# Altium schematic sheet VCAN.SchDoc
size 209 x 148 mm; Author: vseasky; Address1: https://docs.liuwei.vin; Revision: V0.2; SheetNumber: 1; SheetTotal: 4
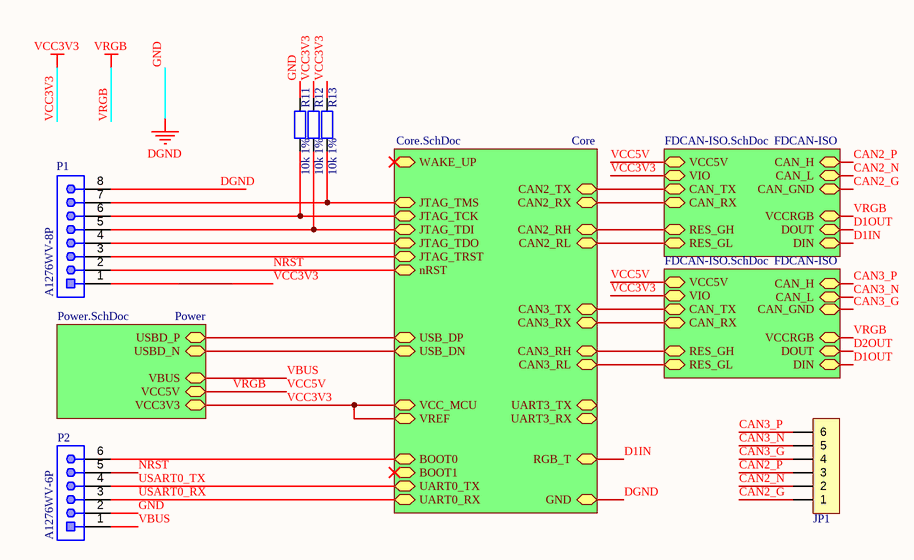
[diagram p0: VCAN.SchDoc]

## Parts
JP1  HDR-1X6  [HT3.96-WI-6P-SMD]  (value not drawn)
P1  A1276WV-8P  [CJT-A1276WV-8P_V]
P2  A1276WV-6P  [CJT-A1276WV-6P_V]
R11  10k 1%  [R 0603_L]
R12  10k 1%  [R 0603_L]
R13  10k 1%  [R 0603_L]

## Sub-sheets
Core = Core.SchDoc: nRST (bidir), WAKE_UP (bidir), JTAG_TDO (bidir), JTAG_TDI (bidir), JTAG_TCK (bidir), JTAG_TMS (bidir), JTAG_TRST (bidir), GND (bidir), USB_DP (bidir), USB_DN (bidir), UART0_TX (bidir), UART0_RX (bidir), VCC_MCU (bidir), VREF (bidir), BOOT0 (bidir), BOOT1 (bidir), UART3_RX (bidir), UART3_TX (bidir), CAN3_RX (bidir), CAN3_TX (bidir), RGB_T (bidir), CAN2_TX (bidir), CAN2_RX (bidir), CAN3_RH (bidir), CAN2_RH (bidir), CAN2_RL (bidir), CAN3_RL (bidir)
FDCAN-ISO = FDCAN-ISO.SchDoc: CAN_H (bidir), CAN_L (bidir), CAN_RX (bidir), CAN_TX (bidir), CAN_GND (bidir), VCC5V (bidir), VIO (bidir), RES_GH (bidir), RES_GL (bidir), VCCRGB (bidir), DOUT (bidir), DIN (bidir)
FDCAN-ISO = FDCAN-ISO.SchDoc: CAN_H (bidir), CAN_L (bidir), CAN_RX (bidir), CAN_TX (bidir), CAN_GND (bidir), VCC5V (bidir), VIO (bidir), RES_GH (bidir), RES_GL (bidir), VCCRGB (bidir), DOUT (bidir), DIN (bidir)
Power = Power.SchDoc: VCC3V3 (bidir), VCC5V (bidir), USBD_P (bidir), USBD_N (bidir), VBUS (bidir)

## Nets
DGND: P1.8 P2.2 R11.1 ; sheet Core/GND  [also labelled GND]
VCC3V3: P1.1 R12.1 R13.1 ; sheet Core/VCC_MCU, sheet Core/VREF, sheet Power/VCC3V3, sheet FDCAN-ISO/VIO, sheet FDCAN-ISO/VIO
VCC5V: sheet Power/VCC5V, sheet FDCAN-ISO/VCC5V, sheet FDCAN-ISO/VCCRGB, sheet FDCAN-ISO/VCC5V, sheet FDCAN-ISO/VCCRGB  [also labelled VRGB]
CAN2_G: JP1.1 ; sheet FDCAN-ISO/CAN_GND
CAN2_N: JP1.2 ; sheet FDCAN-ISO/CAN_L
CAN2_P: JP1.3 ; sheet FDCAN-ISO/CAN_H
CAN3_G: JP1.4 ; sheet FDCAN-ISO/CAN_GND
CAN3_N: JP1.5 ; sheet FDCAN-ISO/CAN_L
CAN3_P: JP1.6 ; sheet FDCAN-ISO/CAN_H
D1IN: sheet Core/RGB_T, sheet FDCAN-ISO/DIN
D1OUT: sheet FDCAN-ISO/DOUT, sheet FDCAN-ISO/DIN
D2OUT: sheet FDCAN-ISO/DOUT
NRST: P1.2 P2.5 ; sheet Core/nRST
USART0_RX: P2.3 ; sheet Core/UART0_RX
USART0_TX: P2.4 ; sheet Core/UART0_TX
VBUS: P2.1 ; sheet Power/VBUS
NetP1_3: P1.3 ; sheet Core/JTAG_TRST
NetP1_4: P1.4 ; sheet Core/JTAG_TDO
NetP1_5: P1.5 R12.2 ; sheet Core/JTAG_TDI
NetP1_6: P1.6 R11.2 ; sheet Core/JTAG_TCK
NetP1_7: P1.7 R13.2 ; sheet Core/JTAG_TMS
NetP2_6: P2.6 ; sheet Core/BOOT0
(unnamed): sheet Core/USB_DP, sheet Power/USBD_P
(unnamed): sheet Core/USB_DN, sheet Power/USBD_N
(unnamed): sheet Core/CAN3_RX, sheet FDCAN-ISO/CAN_RX
(unnamed): sheet Core/CAN3_TX, sheet FDCAN-ISO/CAN_TX
(unnamed): sheet Core/CAN2_TX, sheet FDCAN-ISO/CAN_TX
(unnamed): sheet Core/CAN2_RX, sheet FDCAN-ISO/CAN_RX
(unnamed): sheet Core/CAN3_RH, sheet FDCAN-ISO/RES_GH
(unnamed): sheet Core/CAN2_RH, sheet FDCAN-ISO/RES_GH
(unnamed): sheet Core/CAN2_RL, sheet FDCAN-ISO/RES_GL
(unnamed): sheet Core/CAN3_RL, sheet FDCAN-ISO/RES_GL

## Library data of the parts
JP1 = Header 6: 6P接插件
P1 = A1276WV-8P: Pin Header, 1.27mm Pitch 180° Single Row, 1 x 8 Position, Height 3.7 mm, -40 to 105 degC, RoHS; Manufacturer: Changjiang Connectors; Contact Resistance: 20mΩ; Current (Max): 1A; Insulation Resistance: 1000MΩ; No. of Rows: 1; No. of Positions: 8; Operating Voltage (V AC/DC): 30V; PIN Material: Brass; PIN Plating: Gold over Nickel; Product Series: A1276 Series; ComponentLink1Description: Manufacturer; ComponentLink1URL: http://www.cjt.com/; ComponentLink2Description: Datasheet; ComponentLink2URL: http://www.cjt.com/UP/A1276WV-XP_dwg.pdf; Part Number: A1276WV-8P; Pitch: 1.27mm; Datasheet Version: REV. A0, 06/2014; Assembly Type: Wafer; Category: Wire to Board; Color: Black; Housing Material: PBT,UL94V-0; Operating Temperature Range: -40℃~105℃; Publisher: Bolgen Studio
P2 = A1276WV-6P: Pin Header, 1.27mm Pitch 180° Single Row, 1 x 6 Position, Height 3.7 mm, -40 to 105 degC, RoHS; Manufacturer: Changjiang Connectors; Contact Resistance: 20mΩ; Current (Max): 1A; Insulation Resistance: 1000MΩ; No. of Rows: 1; No. of Positions: 6; Operating Voltage (V AC/DC): 30V; PIN Material: Brass; PIN Plating: Gold over Nickel; Product Series: A1276 Series; ComponentLink1Description: Manufacturer; ComponentLink1URL: http://www.cjt.com/; ComponentLink2Description: Datasheet; ComponentLink2URL: http://www.cjt.com/UP/A1276WV-XP_dwg.pdf; Part Number: A1276WV-6P; Pitch: 1.27mm; Datasheet Version: REV. A0, 06/2014; Assembly Type: Wafer; Category: Wire to Board; Color: Black; Housing Material: PBT,UL94V-0; Operating Temperature Range: -40℃~105℃; Publisher: Bolgen Studio
R11-R13 = R: 贴片电阻